# Altium schematic sheet Isolator_Gate_Driver.SchDoc
size A4; SheetNumber: 10; SheetTotal: 16
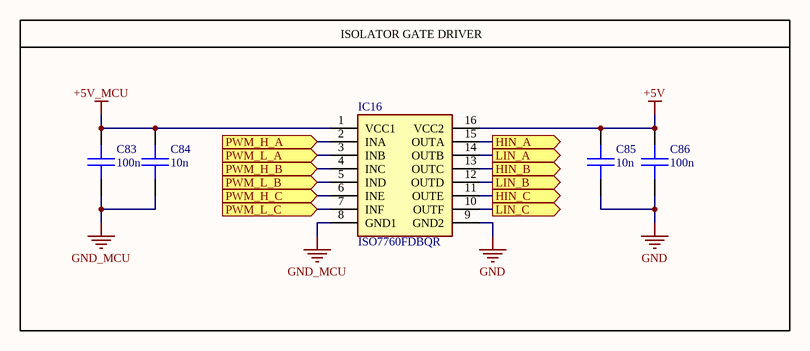
[diagram p0: Isolator_Gate_Driver.SchDoc]

## Parts
C83  100n  [C_0603]
C84  10n  [C_0603]
C85  10n  [C_0603]
C86  100n  [C_0603]
IC16  ISO7760FDBQR  [SOP64P600X175-16N]

## Blocks framed on the sheet
ISOLATOR GATE DRIVER: C83-C86 IC16

## Ports
HIN_A (out, see Interconnections[4C], Gate_Drivers[1A]), HIN_B (out, see Interconnections[4C], Gate_Drivers[4A]), HIN_C (out, see Interconnections[4C], Gate_Drivers[6A]), LIN_A (out, see Interconnections[4C], Gate_Drivers[1A]), LIN_B (out, see Interconnections[4C], Gate_Drivers[4A]), LIN_C (out, see Interconnections[4C], Gate_Drivers[6A]), PWM_H_A (in, see Interconnections[5C], Microcontroller[4B]), PWM_H_B (in, see Interconnections[5C], Microcontroller[4B]), PWM_H_C (in, see Interconnections[5C], Microcontroller[4B]), PWM_L_A (in, see Interconnections[5C], Microcontroller[4B]), PWM_L_B (in, see Interconnections[5C], Microcontroller[4B]), PWM_L_C (in, see Interconnections[5C], Microcontroller[4B])

## Nets
+5V: C85.2 C86.2 IC16.16(VCC2)
+5V_MCU: C83.2 C84.2 IC16.1(VCC1)
GND: C85.1 C86.1 IC16.9(GND2)
GND_MCU: C83.1 C84.1 IC16.8(GND1)
HIN_A: IC16.15(OUTA) ; port HIN_A
HIN_B: IC16.13(OUTC) ; port HIN_B
HIN_C: IC16.11(OUTE) ; port HIN_C
LIN_A: IC16.14(OUTB) ; port LIN_A
LIN_B: IC16.12(OUTD) ; port LIN_B
LIN_C: IC16.10(OUTF) ; port LIN_C
PWM_H_A: IC16.2(INA) ; port PWM_H_A
PWM_H_B: IC16.4(INC) ; port PWM_H_B
PWM_H_C: IC16.6(INE) ; port PWM_H_C
PWM_L_A: IC16.3(INB) ; port PWM_L_A
PWM_L_B: IC16.5(IND) ; port PWM_L_B
PWM_L_C: IC16.7(INF) ; port PWM_L_C

## Library data of the parts
C83-C86 = CAP: SMD Chip Capacitor
IC16 = ISO7760FDBQR: Integrated Circuit; Manufacturer_Name: Texas Instruments; Datasheet Link: https://www.ti.com/lit/ds/symlink/iso7760.pdf?ts=1635771024326&ref_url=https%253A%252F%252Fwww.ti.com%252Fproduct%252FISO7760; Height: 1.75mm; Manufacturer_Part_Number: ISO7760FDBQR; Mouser Part Number: 595-ISO7760FDBQR; Mouser Price/Stock: https://www.mouser.co.uk/ProductDetail/Texas-Instruments/ISO7760FDBQR?qs=rrS6PyfT74eAAfpmQeXWaw%3D%3D; Arrow Part Number: ISO7760FDBQR; Arrow Price/Stock: https://www.arrow.com/en/products/iso7760fdbqr/texas-instruments?region=nac